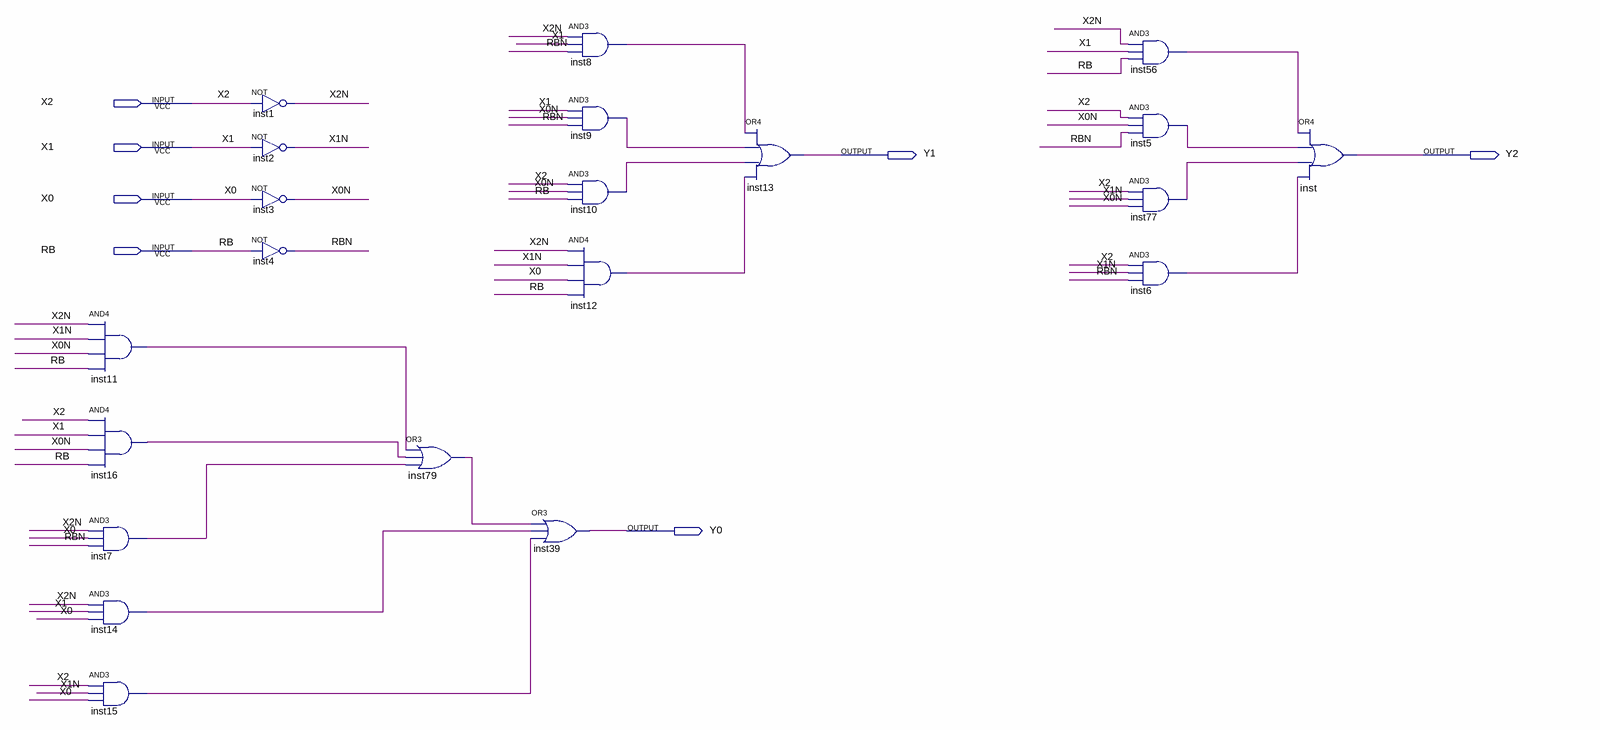
[diagram p0: schematic sheet]
// Quartus schematic My_Counter.bdf as structural Verilog: 21 symbols, 7 pins
module My_Counter (
  input  X2,
  input  X1,
  input  X0,
  input  RB,
  output Y1,
  output Y2,
  output Y0
);

  wire inst5_out, inst6_out, inst7_out, inst8_out, inst9_out, inst10_out, inst11_out, inst12_out, inst14_out,
       inst15_out, inst16_out, inst56_out, inst77_out, inst79_out, RBN, X0N, X1N, X2N;

  and inst11 (inst11_out, X2N, X1N, X0N, RB);
  and inst16 (inst16_out, X2, X1, X0N, RB);
  and inst7 (inst7_out, X2N, X0, RBN);
  and inst14 (inst14_out, X2N, X1, X0);
  and inst15 (inst15_out, X2, X1N, X0);
  not inst1 (X2N, X2);
  not inst2 (X1N, X1);
  not inst3 (X0N, X0);
  not inst4 (RBN, RB);
  or inst79 (inst79_out, inst11_out, inst16_out, inst7_out);
  or inst39 (Y0, inst79_out, inst14_out, inst15_out);
  and inst8 (inst8_out, X2N, X1, RBN);
  and inst9 (inst9_out, X1, X0N, RBN);
  and inst10 (inst10_out, X2, X0N, RB);
  and inst12 (inst12_out, X2N, X1N, X0, RB);
  or inst13 (Y1, inst8_out, inst9_out, inst10_out, inst12_out);
  and inst56 (inst56_out, X2N, X1, RB);
  and inst5 (inst5_out, X2, X0N, RBN);
  and inst77 (inst77_out, X2, X1N, X0N);
  and inst6 (inst6_out, X2, X1N, RBN);
  or inst (Y2, inst56_out, inst5_out, inst77_out, inst6_out);
endmodule
